# Altium project PMI_Alim.PrjPCB
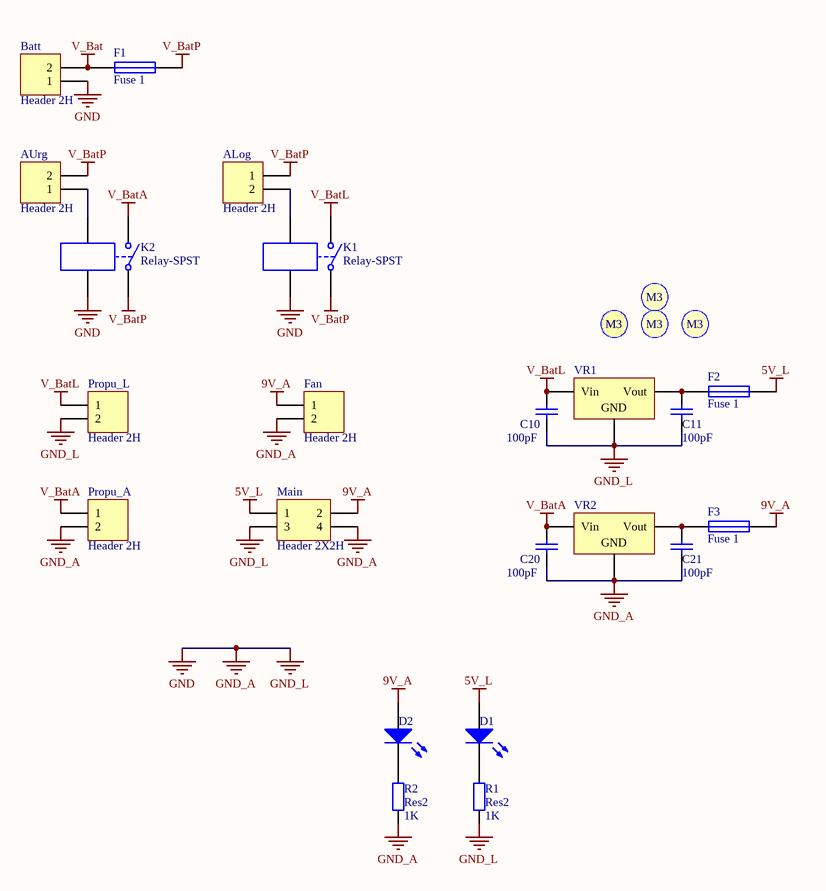
[diagram p0: PMI_Alim.SchDoc]
1 sheet, 27 parts. Net scope: global (net labels, ports and power ports of the same name join across sheets).
Board file: PMI_Alim.PcbDoc

## Sheet PMI_Alim.SchDoc
size A4

### Parts
ALog  Header 2H  [Molex SPOX 2x1H]
AUrg  Header 2H  [Molex SPOX 2x1H]
Batt  Header 2H  [Battery SALE]
C10  value 100pF  [3.2X1.6X1.1]  (hidden comment: Cap)
C11  value 100pF  [3.2X1.6X1.1]  (hidden comment: Cap)
C20  value 100pF  [3.2X1.6X1.1]  (hidden comment: Cap)
C21  value 100pF  [3.2X1.6X1.1]  (hidden comment: Cap)
D1  LED2  [3.2X1.6X1.1]  (value not drawn)
D2  LED2  [3.2X1.6X1.1]  (value not drawn)
F1  Fuse 1  [Fuse]
F2  Fuse 1  [Fuse]
F3  Fuse 1  [Fuse]
Fan  Header 2H  [Molex SPOX 2x1H]
K1  Relay-SPST  [Relay]
K2  Relay-SPST  [Relay]
Main  Header 2X2H  [MOLEX_MINIFITJR_2X2H]
Propu_A  Header 2H  [Molex_MiniFitJr_2x1H]
Propu_L  Header 2H  [Molex_MiniFitJr_2x1H]
R1  Res2  value 1K  [3.2X1.6X1.1]
R2  Res2  value 1K  [3.2X1.6X1.1]
S1  Screw M3  [Screw M3]  (value not drawn)
S2  Screw M3  [Screw M3]  (value not drawn)
S3  Screw M3  [Screw M3]  (value not drawn)
S4  Screw M3  [Screw M3]  (value not drawn)
S5  Screw M3  [Screw M3]  (value not drawn)
VR1  TSR 2-2450  [TRS - centered]  (value not drawn)
VR2  TSR 2-2490  [TRS - centered]  (value not drawn)

### Nets
5V_L: D1.1(A) F2.2 Main.1
9V_A: D2.1(A) F3.2 Fan.1 Main.2
GND: Batt.1 C10.1 C11.1 C20.1 C21.1 Fan.2 K1.3 K2.3 Main.3 Main.4 Propu_A.2 Propu_L.2 R1.2 R2.2 VR1.2(GND) VR2.2(GND)  [also labelled GND_A, GND_L]
V_Bat: Batt.2 F1.1
V_BatA: C20.2 K2.2 Propu_A.1 VR2.1(Vin)
V_BatL: C10.2 K1.2 Propu_L.1 VR1.1(Vin)
V_BatP: ALog.1 AUrg.2 F1.2 K1.1 K2.1
NetALog_2: ALog.2 K1.4
NetAUrg_1: AUrg.1 K2.4
NetC11_2: C11.2 F2.1 VR1.3(Vout)
NetC21_2: C21.2 F3.1 VR2.3(Vout)
NetD1_2: D1.2(K) R1.1
NetD2_2: D2.2(K) R2.1

### Notes on the sheet
- (in symbol Screw M3) M3

### Library data of the parts
ALog AUrg Batt Fan Propu_A Propu_L = Header 2H: Header, 2-Pin, Right Angle; LatestRevisionDate: 17-Jul-2002; LatestRevisionNote: Re-released for DXP Platform.; Publisher: Altium Limited
C10 C11 C20 C21 = Cap: Capacitor; Published: 8-Jun-2000; LatestRevisionDate: 17-Jul-2002; LatestRevisionNote: Re-released for DXP Platform.; PackageReference: RAD-0.3; Publisher: Altium Limited; PackageDescription: Radial Cap, Thru-Hole; 2 Leads; 0.3 in Pin Spacing
D1 D2 = LED2: Typical RED, GREEN, YELLOW, AMBER GaAs LED; Published: 8-Jun-2000; LatestRevisionDate: 17-Jul-2002; LatestRevisionNote: Re-released for DXP Platform.; PackageVersion: Feb-2002; PackageReference: 3.2X1.6X1.1; Publisher: Altium Limited; PackageDescription: SM LED; 2 Flat Leads
F1-F3 = Fuse 1: Fuse; Published: 8-Jun-2000; LatestRevisionDate: 17-Jul-2002; LatestRevisionNote: Re-released for DXP Platform.; PackageReference: PIN-W2/E2.8; Publisher: Altium Limited; PackageDescription: Thru-Hole; 2 Leads
K1 K2 = Relay-SPST: Single-Pole Single-Throw Relay; Published: 24-Mar-1999; LatestRevisionDate: 17-Jul-2002; LatestRevisionNote: Re-released for DXP Platform.; PackageReference: MODULE4; Publisher: Altium Limited
Main = Header 2X2H: Header, 2-Pin, Dual row, Right Angle; LatestRevisionDate: 17-Jul-2002; LatestRevisionNote: Re-released for DXP Platform.; Publisher: Altium Limited
R1 R2 = Res2: Resistor; Published: 8-Jun-2000; LatestRevisionDate: 17-Jul-2002; LatestRevisionNote: Re-released for DXP Platform.; PackageReference: AXIAL-0.4; Publisher: Altium Limited; PackageDescription: Axial Device, Thru-Hole; 2 Leads; 0.4 in Pin Spacing
VR1 VR2 = Volt Reg: Voltage Regulator; Published: 24-Mar-1999; LatestRevisionDate: 29-May-2009; LatestRevisionNote: IPC-7351 Footprint Added.; PackageReference: D2PAK; Publisher: Altium Limited; PackageDescription: 3-Pin Transistor Outline Package 2.54 mm Pitch, 15.1 mm Lead Span